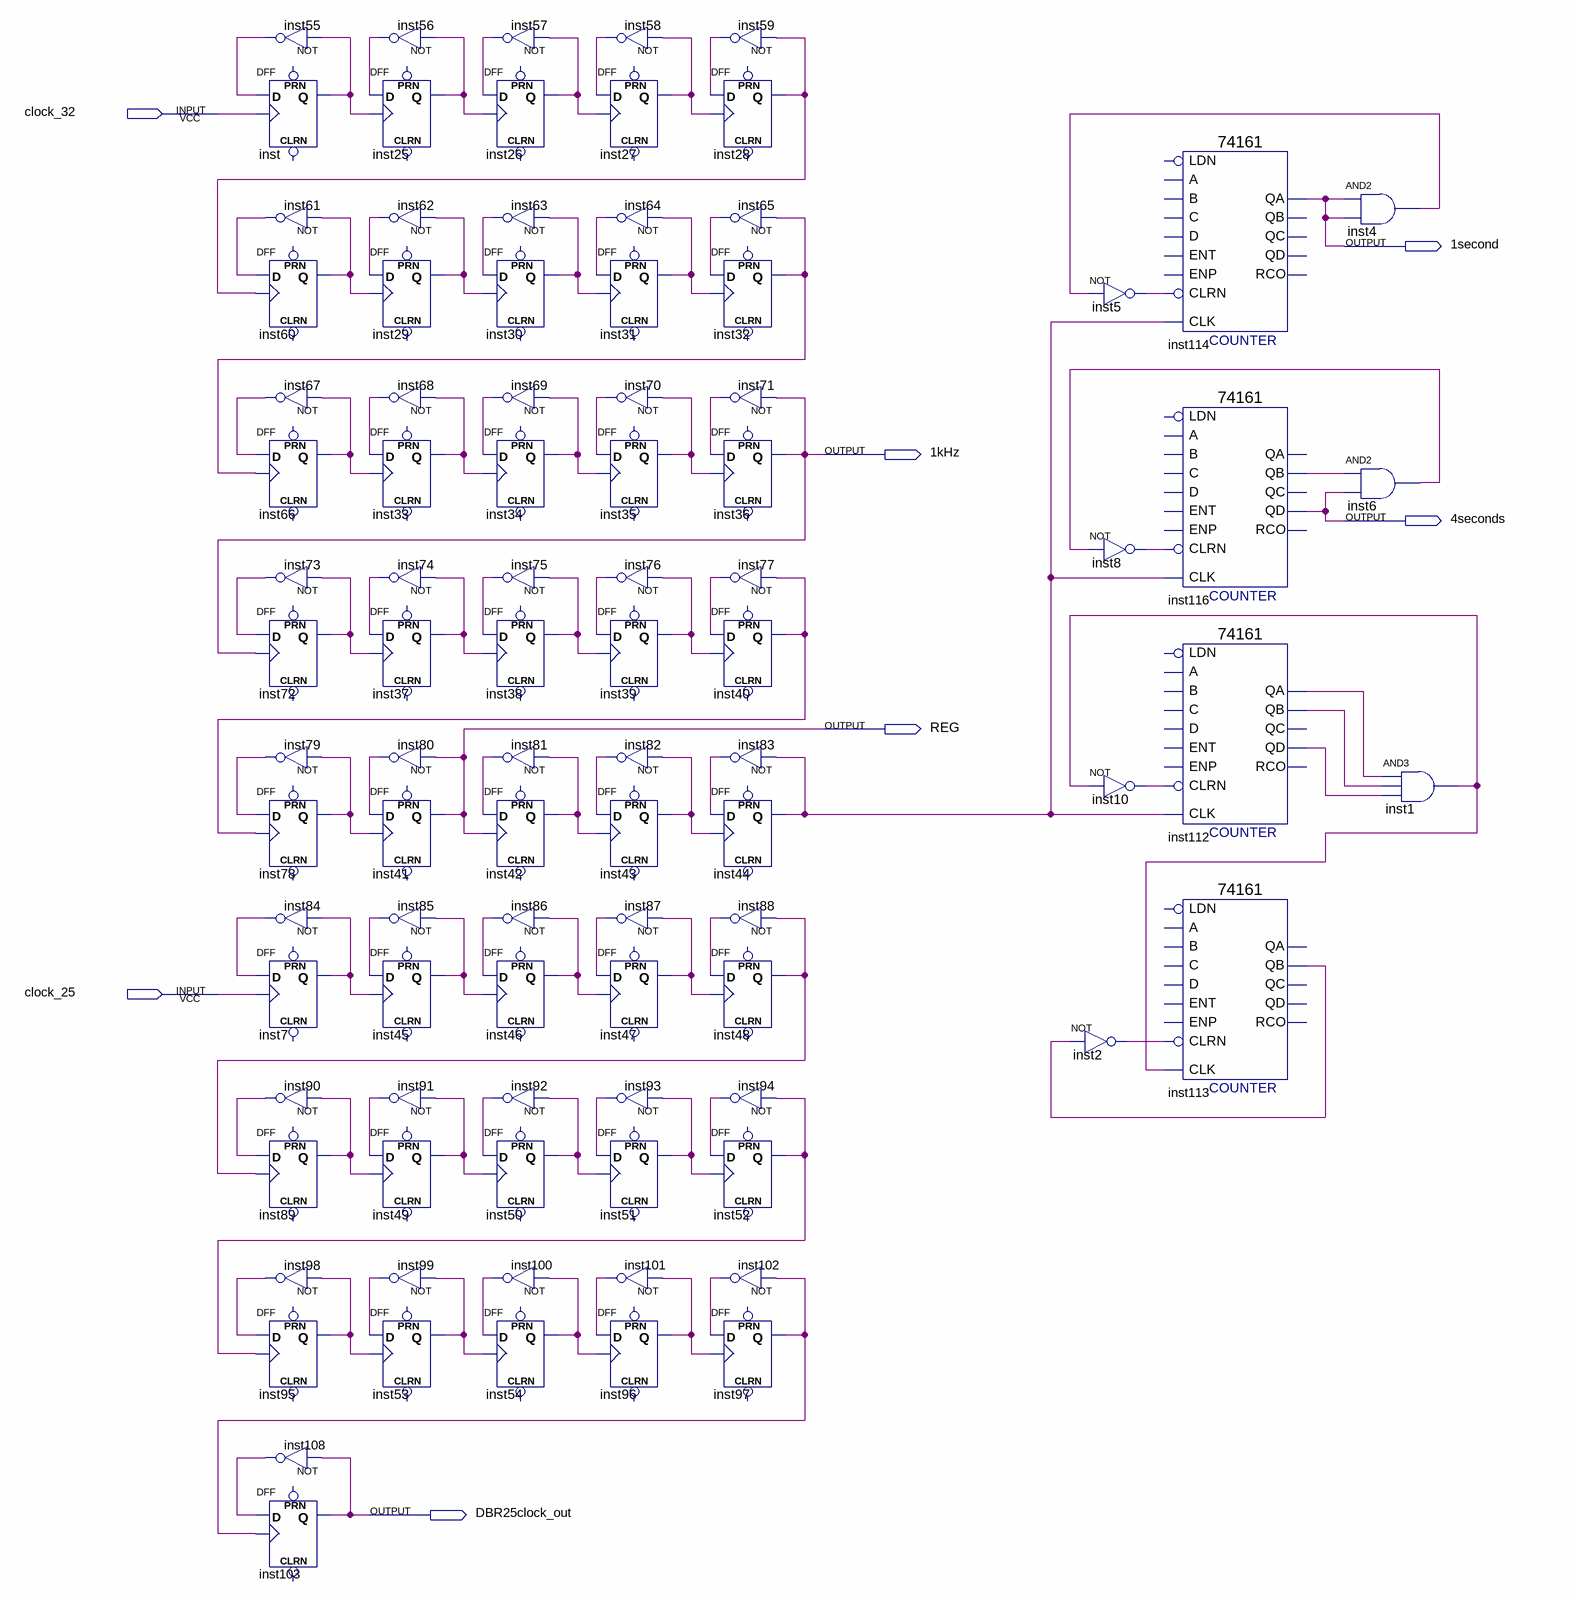
[diagram p0: schematic sheet]
// Quartus schematic Divisor.bdf as structural Verilog: 93 symbols, 7 pins
module Divisor (
  input  clock_32,
  input  clock_25,
  output \1second ,
  output \1kHz ,
  output \4seconds ,
  output REG,
  output DBR25clock_out
);

  wire inst1_out, inst2_out, inst4_out, inst5_out, inst6_out, inst7_q, inst8_out, inst10_out, inst25_q,
       inst26_q, inst27_q, inst28_q, inst29_q, inst30_q, inst31_q, inst32_q, inst33_q, inst34_q, inst35_q,
       inst37_q, inst38_q, inst39_q, inst40_q, inst42_q, inst43_q, inst44_q, inst45_q, inst46_q, inst47_q,
       inst48_q, inst49_q, inst50_q, inst51_q, inst52_q, inst53_q, inst54_q, inst55_out, inst56_out,
       inst57_out, inst58_out, inst59_out, inst60_q, inst61_out, inst62_out, inst63_out, inst64_out,
       inst65_out, inst66_q, inst67_out, inst68_out, inst69_out, inst70_out, inst71_out, inst72_q,
       inst73_out, inst74_out, inst75_out, inst76_out, inst77_out, inst78_q, inst79_out, inst80_out,
       inst81_out, inst82_out, inst83_out, inst84_out, inst85_out, inst86_out, inst87_out, inst88_out,
       inst89_q, inst90_out, inst91_out, inst92_out, inst93_out, inst94_out, inst95_q, inst96_q, inst97_q,
       inst98_out, inst99_out, inst100_out, inst101_out, inst102_out, inst108_out, inst112_qa, inst112_qb,
       inst112_qd, inst113_qb, inst116_qb, inst_q;

  DFF inst (.CLK(clock_32), .D(inst55_out), .Q(inst_q));  // open: CLRN, PRN
  DFF inst60 (.CLK(inst28_q), .D(inst61_out), .Q(inst60_q));  // open: CLRN, PRN
  DFF inst66 (.CLK(inst32_q), .D(inst67_out), .Q(inst66_q));  // open: CLRN, PRN
  DFF inst72 (.CLK(\1kHz ), .D(inst73_out), .Q(inst72_q));  // open: CLRN, PRN
  DFF inst78 (.CLK(inst40_q), .D(inst79_out), .Q(inst78_q));  // open: CLRN, PRN
  DFF inst7 (.CLK(clock_25), .D(inst84_out), .Q(inst7_q));  // open: CLRN, PRN
  DFF inst89 (.CLK(inst48_q), .D(inst90_out), .Q(inst89_q));  // open: CLRN, PRN
  DFF inst95 (.CLK(inst52_q), .D(inst98_out), .Q(inst95_q));  // open: CLRN, PRN
  DFF inst103 (.CLK(inst97_q), .D(inst108_out), .Q(DBR25clock_out));  // open: CLRN, PRN
  not inst55 (inst55_out, inst_q);
  not inst61 (inst61_out, inst60_q);
  not inst67 (inst67_out, inst66_q);
  not inst73 (inst73_out, inst72_q);
  not inst79 (inst79_out, inst78_q);
  not inst84 (inst84_out, inst7_q);
  not inst90 (inst90_out, inst89_q);
  not inst98 (inst98_out, inst95_q);
  not inst108 (inst108_out, DBR25clock_out);
  not inst56 (inst56_out, inst25_q);
  DFF inst25 (.CLK(inst_q), .D(inst56_out), .Q(inst25_q));  // open: CLRN, PRN
  not inst62 (inst62_out, inst29_q);
  DFF inst29 (.CLK(inst60_q), .D(inst62_out), .Q(inst29_q));  // open: CLRN, PRN
  not inst68 (inst68_out, inst33_q);
  DFF inst33 (.CLK(inst66_q), .D(inst68_out), .Q(inst33_q));  // open: CLRN, PRN
  not inst74 (inst74_out, inst37_q);
  DFF inst37 (.CLK(inst72_q), .D(inst74_out), .Q(inst37_q));  // open: CLRN, PRN
  not inst80 (inst80_out, REG);
  DFF inst41 (.CLK(inst78_q), .D(inst80_out), .Q(REG));  // open: CLRN, PRN
  not inst85 (inst85_out, inst45_q);
  DFF inst45 (.CLK(inst7_q), .D(inst85_out), .Q(inst45_q));  // open: CLRN, PRN
  not inst91 (inst91_out, inst49_q);
  DFF inst49 (.CLK(inst89_q), .D(inst91_out), .Q(inst49_q));  // open: CLRN, PRN
  not inst99 (inst99_out, inst53_q);
  DFF inst53 (.CLK(inst95_q), .D(inst99_out), .Q(inst53_q));  // open: CLRN, PRN
  DFF inst26 (.CLK(inst25_q), .D(inst57_out), .Q(inst26_q));  // open: CLRN, PRN
  DFF inst30 (.CLK(inst29_q), .D(inst63_out), .Q(inst30_q));  // open: CLRN, PRN
  DFF inst34 (.CLK(inst33_q), .D(inst69_out), .Q(inst34_q));  // open: CLRN, PRN
  DFF inst38 (.CLK(inst37_q), .D(inst75_out), .Q(inst38_q));  // open: CLRN, PRN
  DFF inst42 (.CLK(REG), .D(inst81_out), .Q(inst42_q));  // open: CLRN, PRN
  DFF inst46 (.CLK(inst45_q), .D(inst86_out), .Q(inst46_q));  // open: CLRN, PRN
  DFF inst50 (.CLK(inst49_q), .D(inst92_out), .Q(inst50_q));  // open: CLRN, PRN
  DFF inst54 (.CLK(inst53_q), .D(inst100_out), .Q(inst54_q));  // open: CLRN, PRN
  not inst57 (inst57_out, inst26_q);
  not inst63 (inst63_out, inst30_q);
  not inst69 (inst69_out, inst34_q);
  not inst75 (inst75_out, inst38_q);
  not inst81 (inst81_out, inst42_q);
  not inst86 (inst86_out, inst46_q);
  not inst92 (inst92_out, inst50_q);
  not inst100 (inst100_out, inst54_q);
  not inst58 (inst58_out, inst27_q);
  DFF inst27 (.CLK(inst26_q), .D(inst58_out), .Q(inst27_q));  // open: CLRN, PRN
  not inst64 (inst64_out, inst31_q);
  DFF inst31 (.CLK(inst30_q), .D(inst64_out), .Q(inst31_q));  // open: CLRN, PRN
  not inst70 (inst70_out, inst35_q);
  DFF inst35 (.CLK(inst34_q), .D(inst70_out), .Q(inst35_q));  // open: CLRN, PRN
  not inst76 (inst76_out, inst39_q);
  DFF inst39 (.CLK(inst38_q), .D(inst76_out), .Q(inst39_q));  // open: CLRN, PRN
  not inst82 (inst82_out, inst43_q);
  DFF inst43 (.CLK(inst42_q), .D(inst82_out), .Q(inst43_q));  // open: CLRN, PRN
  not inst87 (inst87_out, inst47_q);
  DFF inst47 (.CLK(inst46_q), .D(inst87_out), .Q(inst47_q));  // open: CLRN, PRN
  not inst93 (inst93_out, inst51_q);
  DFF inst51 (.CLK(inst50_q), .D(inst93_out), .Q(inst51_q));  // open: CLRN, PRN
  not inst101 (inst101_out, inst96_q);
  DFF inst96 (.CLK(inst54_q), .D(inst101_out), .Q(inst96_q));  // open: CLRN, PRN
  DFF inst28 (.CLK(inst27_q), .D(inst59_out), .Q(inst28_q));  // open: CLRN, PRN
  DFF inst32 (.CLK(inst31_q), .D(inst65_out), .Q(inst32_q));  // open: CLRN, PRN
  DFF inst36 (.CLK(inst35_q), .D(inst71_out), .Q(\1kHz ));  // open: CLRN, PRN
  DFF inst40 (.CLK(inst39_q), .D(inst77_out), .Q(inst40_q));  // open: CLRN, PRN
  DFF inst44 (.CLK(inst43_q), .D(inst83_out), .Q(inst44_q));  // open: CLRN, PRN
  DFF inst48 (.CLK(inst47_q), .D(inst88_out), .Q(inst48_q));  // open: CLRN, PRN
  DFF inst52 (.CLK(inst51_q), .D(inst94_out), .Q(inst52_q));  // open: CLRN, PRN
  DFF inst97 (.CLK(inst96_q), .D(inst102_out), .Q(inst97_q));  // open: CLRN, PRN
  not inst59 (inst59_out, inst28_q);
  not inst65 (inst65_out, inst32_q);
  not inst71 (inst71_out, \1kHz );
  not inst77 (inst77_out, inst40_q);
  not inst83 (inst83_out, inst44_q);
  not inst88 (inst88_out, inst48_q);
  not inst94 (inst94_out, inst52_q);
  not inst102 (inst102_out, inst97_q);
  not inst5 (inst5_out, inst4_out);
  not inst8 (inst8_out, inst6_out);
  not inst10 (inst10_out, inst1_out);
  not inst2 (inst2_out, inst113_qb);
  \74161  inst114 (
    .CLRN(inst5_out), .CLK(inst44_q), .QA(\1second ));  // open: ENP, LDN, A, D, ENT, B, C, QD, QC, QB, RCO
  \74161  inst116 (
    .CLRN(inst8_out), .CLK(inst44_q), .QD(\4seconds ), .QB(inst116_qb));  // open: ENP, LDN, A, D, ENT, B, C, QC, QA, RCO
  \74161  inst112 (
    .CLRN(inst10_out), .CLK(inst44_q), .QD(inst112_qd), .QB(inst112_qb), .QA(inst112_qa));  // open: ENP, LDN, A, D, ENT, B, C, QC, RCO
  \74161  inst113 (
    .CLRN(inst2_out), .CLK(inst1_out), .QB(inst113_qb));  // open: ENP, LDN, A, D, ENT, B, C, QD, QC, QA, RCO
  and inst4 (inst4_out, \1second , \1second );
  and inst6 (inst6_out, inst116_qb, \4seconds );
  and inst1 (inst1_out, inst112_qa, inst112_qb, inst112_qd);
endmodule
